# Altium project BOOSTXL-AUDIOv1_1.PrjPcb (part 2 of 2)

## Sheet BOOSTXL-AUDIO_EVM_Hardware.SchDoc
size 431 x 279 mm; Date: Not shown in title block; ApprovedBy: Not shown in title block; CheckedBy: Not shown in title block; Author: Not shown in title block; CompanyName: Not shown in title block; Engineer: Not shown in title block; Organization: Not shown in title block; Address1: Not shown in title block; Address2: Not shown in title block; Address3: Not shown in title block; Address4: Not shown in title block; DocumentNumber: 1; Revision: Use project parameter SCH_Rev; SheetNumber: 2; SheetTotal: 2; PageSetup: Record=PageOptions|CenterHorizontal=True|CenterVertical=True|PrintScale=1.00|XCorrection=1.00|YCorrection=1.00|PrintKind=0|BorderSize=5000000|LeftOffset=0|BottomOffset=0|Orientation=2|PaperLength=1000|PaperWidth=1000|Scale=100|PaperSource=15|PrintQuality=600|MediaType=1|DitherType=10|PaperKind=Letter|PrintScaleMode=1; CurrentTime: Not shown in title block; CurrentDate: Not shown in title block; Time: Not shown in title block; DocumentFullPathAndName: Not shown in title block; DocumentName: Not shown in title block; ModifiedDate: Not shown in title block; ImagePath: Not shown in title block
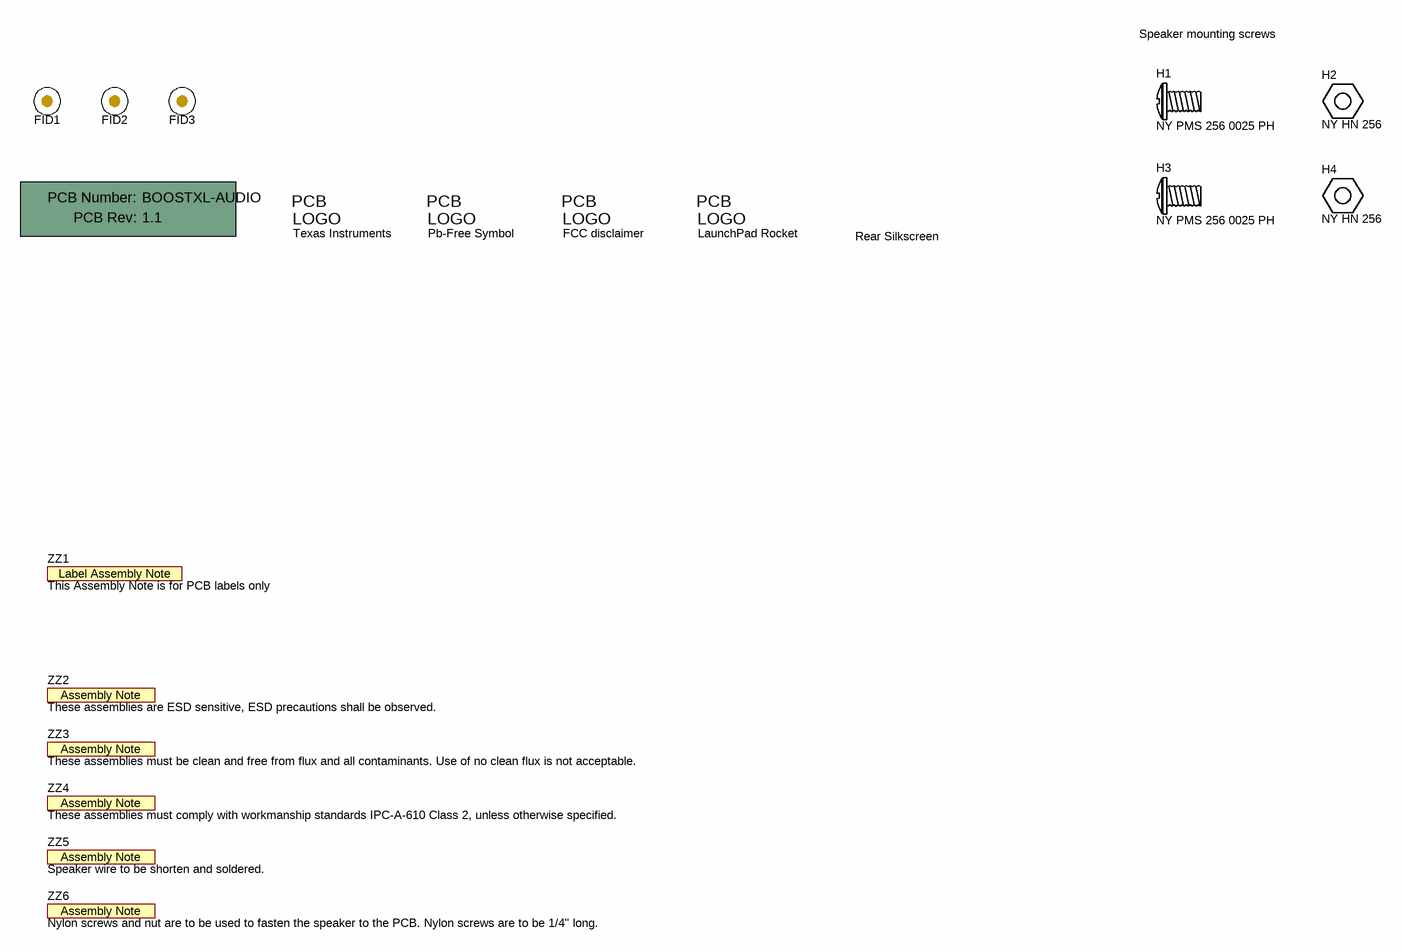
[diagram p1: BOOSTXL-AUDIO_EVM_Hardware.SchDoc]

### Parts
!PCB1  Printed Circuit Board  (value not drawn)  (mechanical)
FID1  Fiducial  [Fiducial10-20]  (value not drawn)
FID2  Fiducial  [Fiducial10-20]  (value not drawn)
FID3  Fiducial  [Fiducial10-20]  (value not drawn)
H1  NY PMS 256 0025 PH  (mechanical)
H2  NY HN 256  (mechanical)
H3  NY PMS 256 0025 PH  (mechanical)
H4  NY HN 256  (mechanical)
Logo1  Texas Instruments  [TI_Stacked_Overlay_Small]  (no BOM)
Logo2  Pb-Free Symbol  [Pb-Free_Overlay_Small]  (no BOM)
Logo3  FCC disclaimer  [FCC_disclaimer]  (no BOM)
Logo4  LaunchPad Rocket  [LaunchPadRocket_Small]  (no BOM)
S?  (no value)  [BOOSTXL-AUDIO_RearSilk]
ZZ1  This Assembly Note is for PCB labels only  [AssemblyNoteLabel]  (no BOM)
ZZ2  These assemblies are ESD sensitive, ESD precautions shall be observed.  [AssemblyNote]  (no BOM)
ZZ3  These assemblies must be clean and free from flux and all contaminants. Use of no clean flux is not acceptable.  [AssemblyNote]  (no BOM)
ZZ4  These assemblies must comply with workmanship standards IPC-A-610 Class 2, unless otherwise specified.  [AssemblyNote]  (no BOM)
ZZ5  Speaker wire to be shorten and soldered.  [AssemblyNote]  (no BOM)
ZZ6  Nylon screws and nut are to be used to fasten the speaker to the PCB. Nylon screws are to be 1/4" long.  [AssemblyNote]  (no BOM)

### Notes on the sheet
- Speaker mounting screws
- Drawn By:
- SVN Rev:
- Number:
- TID #:
- Orderable:
- Rev:
- Sheet Title:
- File:
- Project Title:
- Designed for:
- Assembly Variant:
- Mod. Date:
- Sheet:
- Size:
- of
- B
- http://www.ti.com
- Texas Instruments and/or its licensors do not warrant the accuracy or completeness of this specification or any information contained therein. Texas Instruments and/or its licensors do not warrant that this design will meet the specifications, will be suitable for your application or fit for any particular purpose, or will operate in an implementation. Texas Instruments and/or its licensors do not warrant that the design is production worthy. You should completely validate and test your design implementation to confirm the system functionality for your application.
- Engineer:
- Contact:
- © Texas Instruments
- (in symbol AssemblyNote) Assembly Note
- (in symbol AssemblyNoteLabel) Label Assembly Note
- (in symbol FCC_disclaimer) PCB; LOGO
- (in symbol LaunchPad_Rocket) PCB; LOGO
- (in symbol Pb-Free) PCB; LOGO
- (in symbol PCB) PCB Number:; PCB Rev:
- (in symbol TI_Logo) PCB; LOGO

### Library data of the parts
!PCB1 = PCB: Manufacturer: Any; PartNumber: BOOSTXL-AUDIO; SymbolCreator: a0412235; SymbolVersion: 2012-05-30; CompType: PCB; RoHS: O; MountType: N/A; Publisher: Texas Instruments; LatestRevisionDate: 2012-06-27; LatestRevisionNote: Initial Version; Alternate Manufacturer: -; Alternate PartNumber: -
FID1-FID3 = Fiducial: Fiducial mark.  There is nothing to buy or mount.; SymbolCreator: codlsc; SymbolVersion: 2009-11-4; CompType: Fiducial; Publisher: Texas Instruments; LatestRevisionDate: 2014-08-01; LatestRevisionNote: Added Alternate PartNumber and Alternate Manufacturer parameters to appropriate components.; Manufacturer: N/A; MountType: N/A; PackageReference: Fiducial; PartNumber: N/A; ClassName: FiducialMark
H1 H3 = NY PMS 256 0025 PH: Nylon Screw, Panhead, Phillips, 2-56; Manufacturer: B&F Fastener Supply; SymbolCreator: a0412235; SymbolVersion: 2013-11-25; CompType: Nylon Screw; PartNumber: NY PMS 256 0025 PH; RoHS: Y; MountType: N/A; ComponentLink1Description: Datasheet Link; ComponentLink1URL: http://www.fasnetdirect.com/refguide/Nylpanms.pdf; Publisher: Texas Instruments; LatestRevisionDate: 2015-04-14; Supplier 1: Digi-Key; Supplier Part Number 1: H530-ND
H2 H4 = NY HN 256: Nylon Nut, 2-56, 3/16"; Manufacturer: B&F Fastener Supply; SymbolCreator: a0412235; SymbolVersion: 2014-10-11; CompType: Nylon Nut; PartNumber: NY HN 256; RoHS: Y; MountType: N/A; ComponentLink1Description: Datasheet Link; ComponentLink1URL: http://www.fasnetdirect.com/refguide/Nylhexnut.pdf; Publisher: Texas Instruments; LatestRevisionDate: 2015-04-14; Supplier 1: Digi-Key; Supplier Part Number 1: H612-ND
Logo1 = TI_Logo: Texas Instrument Corporate Signature; SymbolCreator: codlsc; SymbolVersion: 2011-08-22; Published: 2009-03-03; Publisher: National Semiconductor; ClassName: Logo; LatestRevisionDate: 2011-10-25; LatestRevisionNote: Added ClassName of Logo.
Logo2 = Pb-Free: SymbolCreator: a0412235; SymbolVersion: 2011-08-22; Published: 2009-03-03; Publisher: Texas Instruments; LatestRevisionDate: 2014-08-05
Logo3 = FCC_disclaimer: SymbolCreator: codlsc; SymbolVersion: 2011-08-22; Published: 2009-03-03; Publisher: Texas Instruments; LatestRevisionDate: 2014-11-20
Logo4 = LaunchPad_Rocket: LaunchPad Rocket logo; SymbolCreator: a0412235; SymbolVersion: 2011-08-22; Published: 2009-03-03; Publisher: Texas Instruments; LatestRevisionDate: 2014-11-20
S? = Rear Silkscreen: SymbolCreator: a0273630; U/M: EA, IN, or GM; SymbolVersion: 2015-08-14; MountType: N/A; RoHS: Y; CompType: Silkscreen; Alternate PartNumber: -; Alternate Manufacturer: -
ZZ1 = AssemblyNoteLabel: SymbolCreator: a0412235; SymbolVersion: 2012-06-14; CompType: AssemblyNote; ClassName: AssemblyNote; Publisher: Texas Instruments; LatestRevisionDate: 2012-07-31; LatestRevisionNote: Initial Version; Alternate Manufacturer: -; Alternate PartNumber: -
ZZ2-ZZ6 = AssemblyNote: SymbolCreator: codlsc; SymbolVersion: 2010-05-18; CompType: AssemblyNote; ClassName: AssemblyNote; Publisher: Texas Instruments; LatestRevisionDate: 2012-06-14; LatestRevisionNote: Initial Version; Alternate Manufacturer: -; Alternate PartNumber: -

## Assembly variants
Production: not fitted FID1 FID2 FID3 R3 R5 R8 R10 TP1 TP2